# EAGLE design untitled (EAGLE 7.3.0)
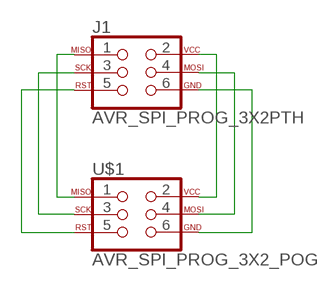
[diagram p0: schematic, sheet 1]

## Parts
J1  AVR_SPI_PROG_3X2PTH  [2X3]
U$1  AVR_SPI_PROG_3X2_POGO  [2X3-POGO]

## Nets
N$1: J1.1 U$1.1
N$2: J1.3 U$1.3
N$3: J1.5 U$1.5
N$4: J1.2 U$1.2
N$5: J1.4 U$1.4
N$6: J1.6 U$1.6

## Library data of the parts
J1 = SparkFun-Connectors:AVR_SPI_PROG_3X2: AVR ISP 6 Pin This is the reduced ISP connector for AVR programming. Common on Arduino. This footprint will take up less PCB space and can be used with a 10-pin to 6-pin adapter such as SKU: BOB-08508 **Special note about "TEST_POINT" package. The stop mask is on the top side, so if you want your programming test points to be on the bottom of your board, make sure to place this package on the bottom side of the board. This also ensure that the orientation to program from the bottom side will be correct. SparkFun Products: SparkFun ISP Pogo Adapter <https://www.sparkfun.com/products/11591> - NS Tiny AVR Programmer <https://www.sparkfun.com/products/11801> -PTH
U$1 = jonsowman:AVR_SPI_PROG_3X2_POGO

## Board
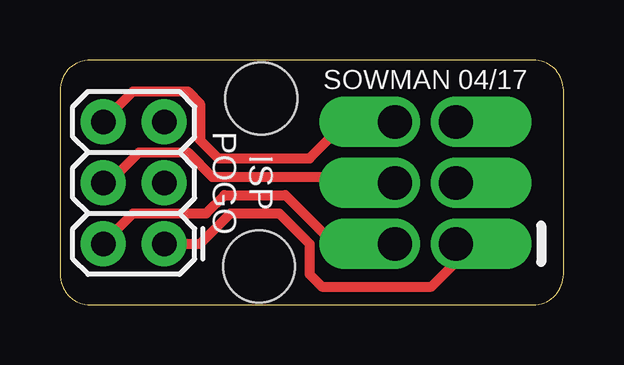
[diagram p1: board, top side]
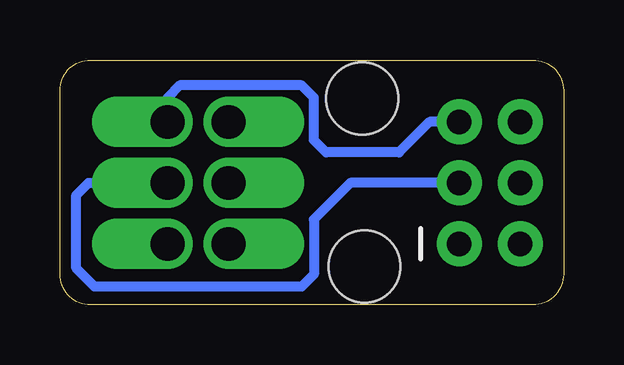
[diagram p2: board, bottom side, seen from below]

Size 21 x 10.2 mm. Coordinates in mm from the lower left corner, seen from the top.
Outline: 0,8.93 0,1.27 arc90 1.27,0 19.73,0 arc90 21,1.27 21,8.93 arc90 19.73,10.2 1.27,10.2 arc90 0,8.93
Copper layers (1*16): Top 0.035mm / dielectric 1.5mm / Bottom 0.035mm
Design rules "dirt_cheap_dirty_boards.v1": minimum track width 5mil, minimum drill 12mil, track to track 5mil, track to pad 5mil, pad to pad 5mil, via to via 5mil, smd to smd 0mil, copper to edge 10mil, drill to drill 10mil, minimum pad ring 10mil, minimum via ring 6mil, stop-mask expansion 2mil, vias tented up to drill 25mil, thermal gap 10mil
Holes 3 mm at 8.4,8.6 8.3,1.6

### Footprints (pad centres in the part's own frame; a part is rotated, then mirrored left to right if it is on the bottom)
2X3 = drill 1.016 pad 1.88: 1 0,0; 2 0,2.54; 3 2.54,0; 4 2.54,2.54; 5 5.08,0; 6 5.08,2.54
2X3-POGO = drill 1.4 pad 1.93 offset: 1 -2.54,0; 2 -2.54,2.54; 3 0,0; 4 0,2.54; 5 2.54,0; 6 2.54,2.54

### Placement (x,y rotation side)
J1  4.35,2.54 90 top
U$1  16.51,5.08 90 top

### Tracks (layer width: path | path; a pad name or v marks a point on that pad's centre or on a via)
N$1
  Top 0.406: J1.1 5.84,2.54 7.11,3.81 9.14,3.81 10.41,2.54 10.41,1.27 10.92,0.76 15.49,0.76 16.51,1.78 U$1.1
N$2
  Bottom 0.406: J1.3 8.89,5.08 10.41,3.56 10.41,1.27 10.92,0.76 19.56,0.76 20.32,1.52 20.32,4.57 19.81,5.08 U$1.3
N$3
  Bottom 0.406: J1.5 5.59,7.62 6.86,6.35 9.91,6.35 10.41,6.86 10.41,8.64 10.92,9.14 16,9.14 16.51,8.64 U$1.5
N$4
  Top 0.406: J1.2 1.81,2.57 3.05,3.81 6.1,3.81 6.86,4.57 9.4,4.57 11.43,2.54 U$1.2
N$5
  Top 0.406: J1.4 2.03,5.08 3.3,6.35 5.33,6.35 6.35,5.33 13.72,5.33 U$1.4
N$6
  Top 0.406: J1.6 1.81,7.65 3.05,8.89 5.33,8.89 5.84,8.38 5.84,6.86 6.6,6.1 10.41,6.1 11.94,7.62 U$1.6

### Text on the board
tPlace: SOWMAN 04/17 | ISP / POGO